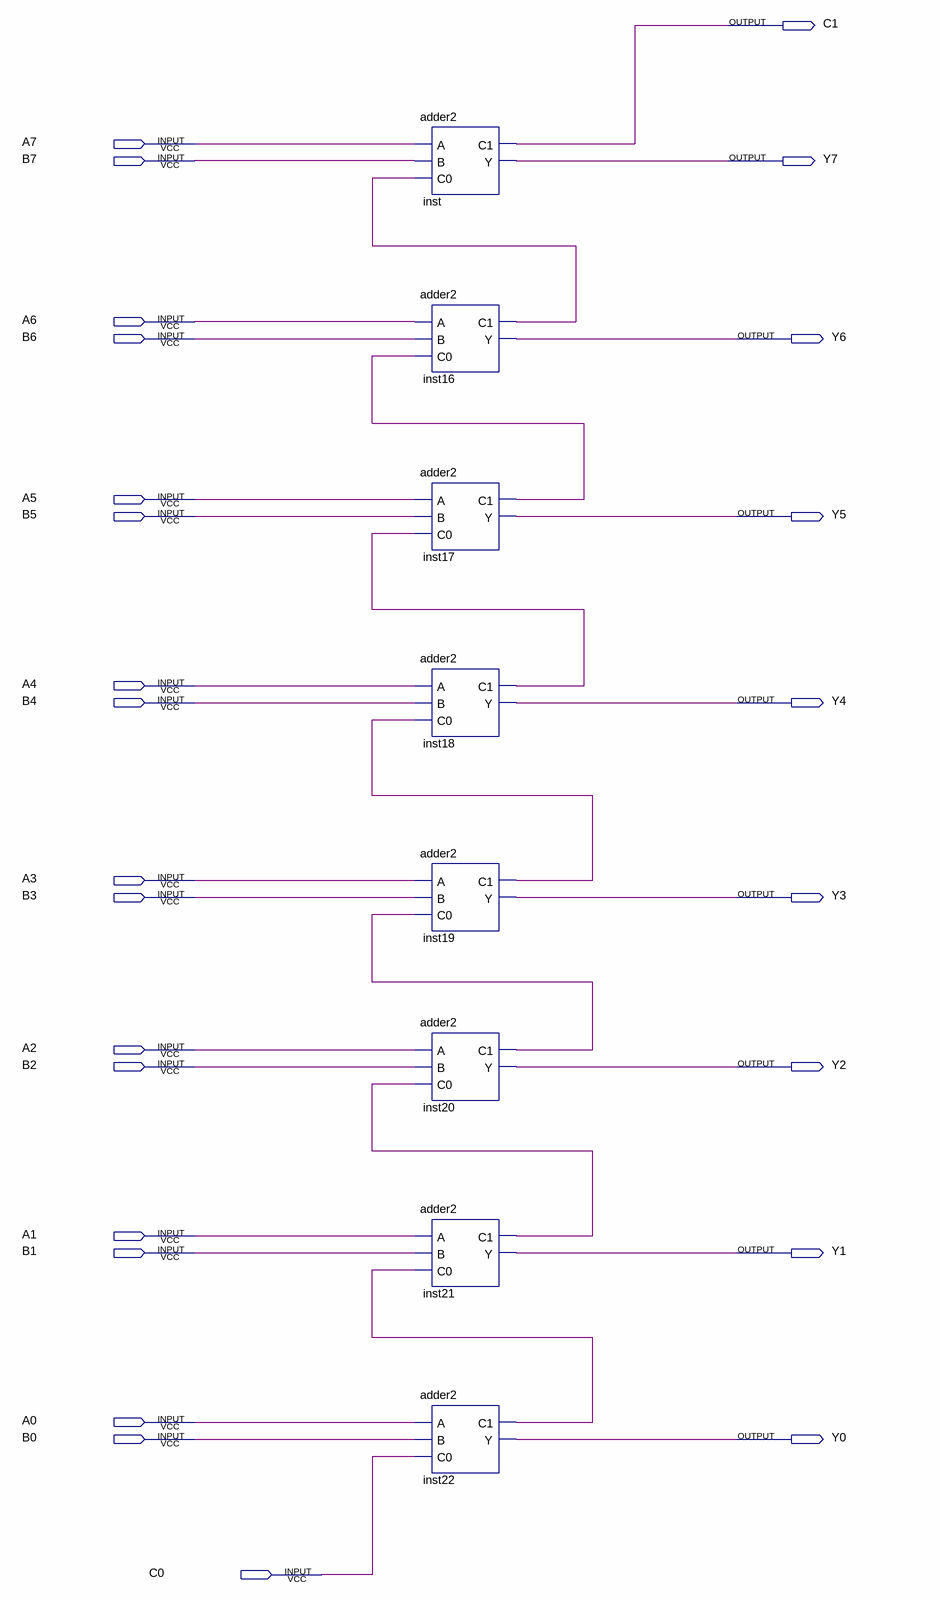
[diagram p0: schematic sheet]
// Quartus schematic adder8.bdf as structural Verilog: 8 symbols, 26 pins
module adder8 (
  input  A7,
  input  B7,
  input  A6,
  input  B6,
  input  A5,
  input  B5,
  input  A4,
  input  B4,
  input  A3,
  input  B3,
  input  A2,
  input  B2,
  input  A1,
  input  B1,
  input  A0,
  input  B0,
  input  C0,
  output C1,
  output Y7,
  output Y6,
  output Y5,
  output Y4,
  output Y3,
  output Y2,
  output Y1,
  output Y0
);

  wire inst16_c1, inst17_c1, inst18_c1, inst19_c1, inst20_c1, inst21_c1, inst22_c1;

  adder2 inst (.A(A7), .B(B7), .C0(inst16_c1), .C1(C1), .Y(Y7));
  adder2 inst16 (.A(A6), .B(B6), .C0(inst17_c1), .C1(inst16_c1), .Y(Y6));
  adder2 inst17 (.A(A5), .B(B5), .C0(inst18_c1), .C1(inst17_c1), .Y(Y5));
  adder2 inst18 (.A(A4), .B(B4), .C0(inst19_c1), .C1(inst18_c1), .Y(Y4));
  adder2 inst19 (.A(A3), .B(B3), .C0(inst20_c1), .C1(inst19_c1), .Y(Y3));
  adder2 inst20 (.A(A2), .B(B2), .C0(inst21_c1), .C1(inst20_c1), .Y(Y2));
  adder2 inst21 (.A(A1), .B(B1), .C0(inst22_c1), .C1(inst21_c1), .Y(Y1));
  adder2 inst22 (.A(A0), .B(B0), .C0(C0), .C1(inst22_c1), .Y(Y0));
endmodule
